# EasyEDA schematic SCH_RP2040-sussybaka_2024-10-22.json
TITLE: Amogus Buzzer - RP2040; REV: 2.0; Date: 2024-08-30; Sheet: 1/1; Company: Sussy Imposter Co.
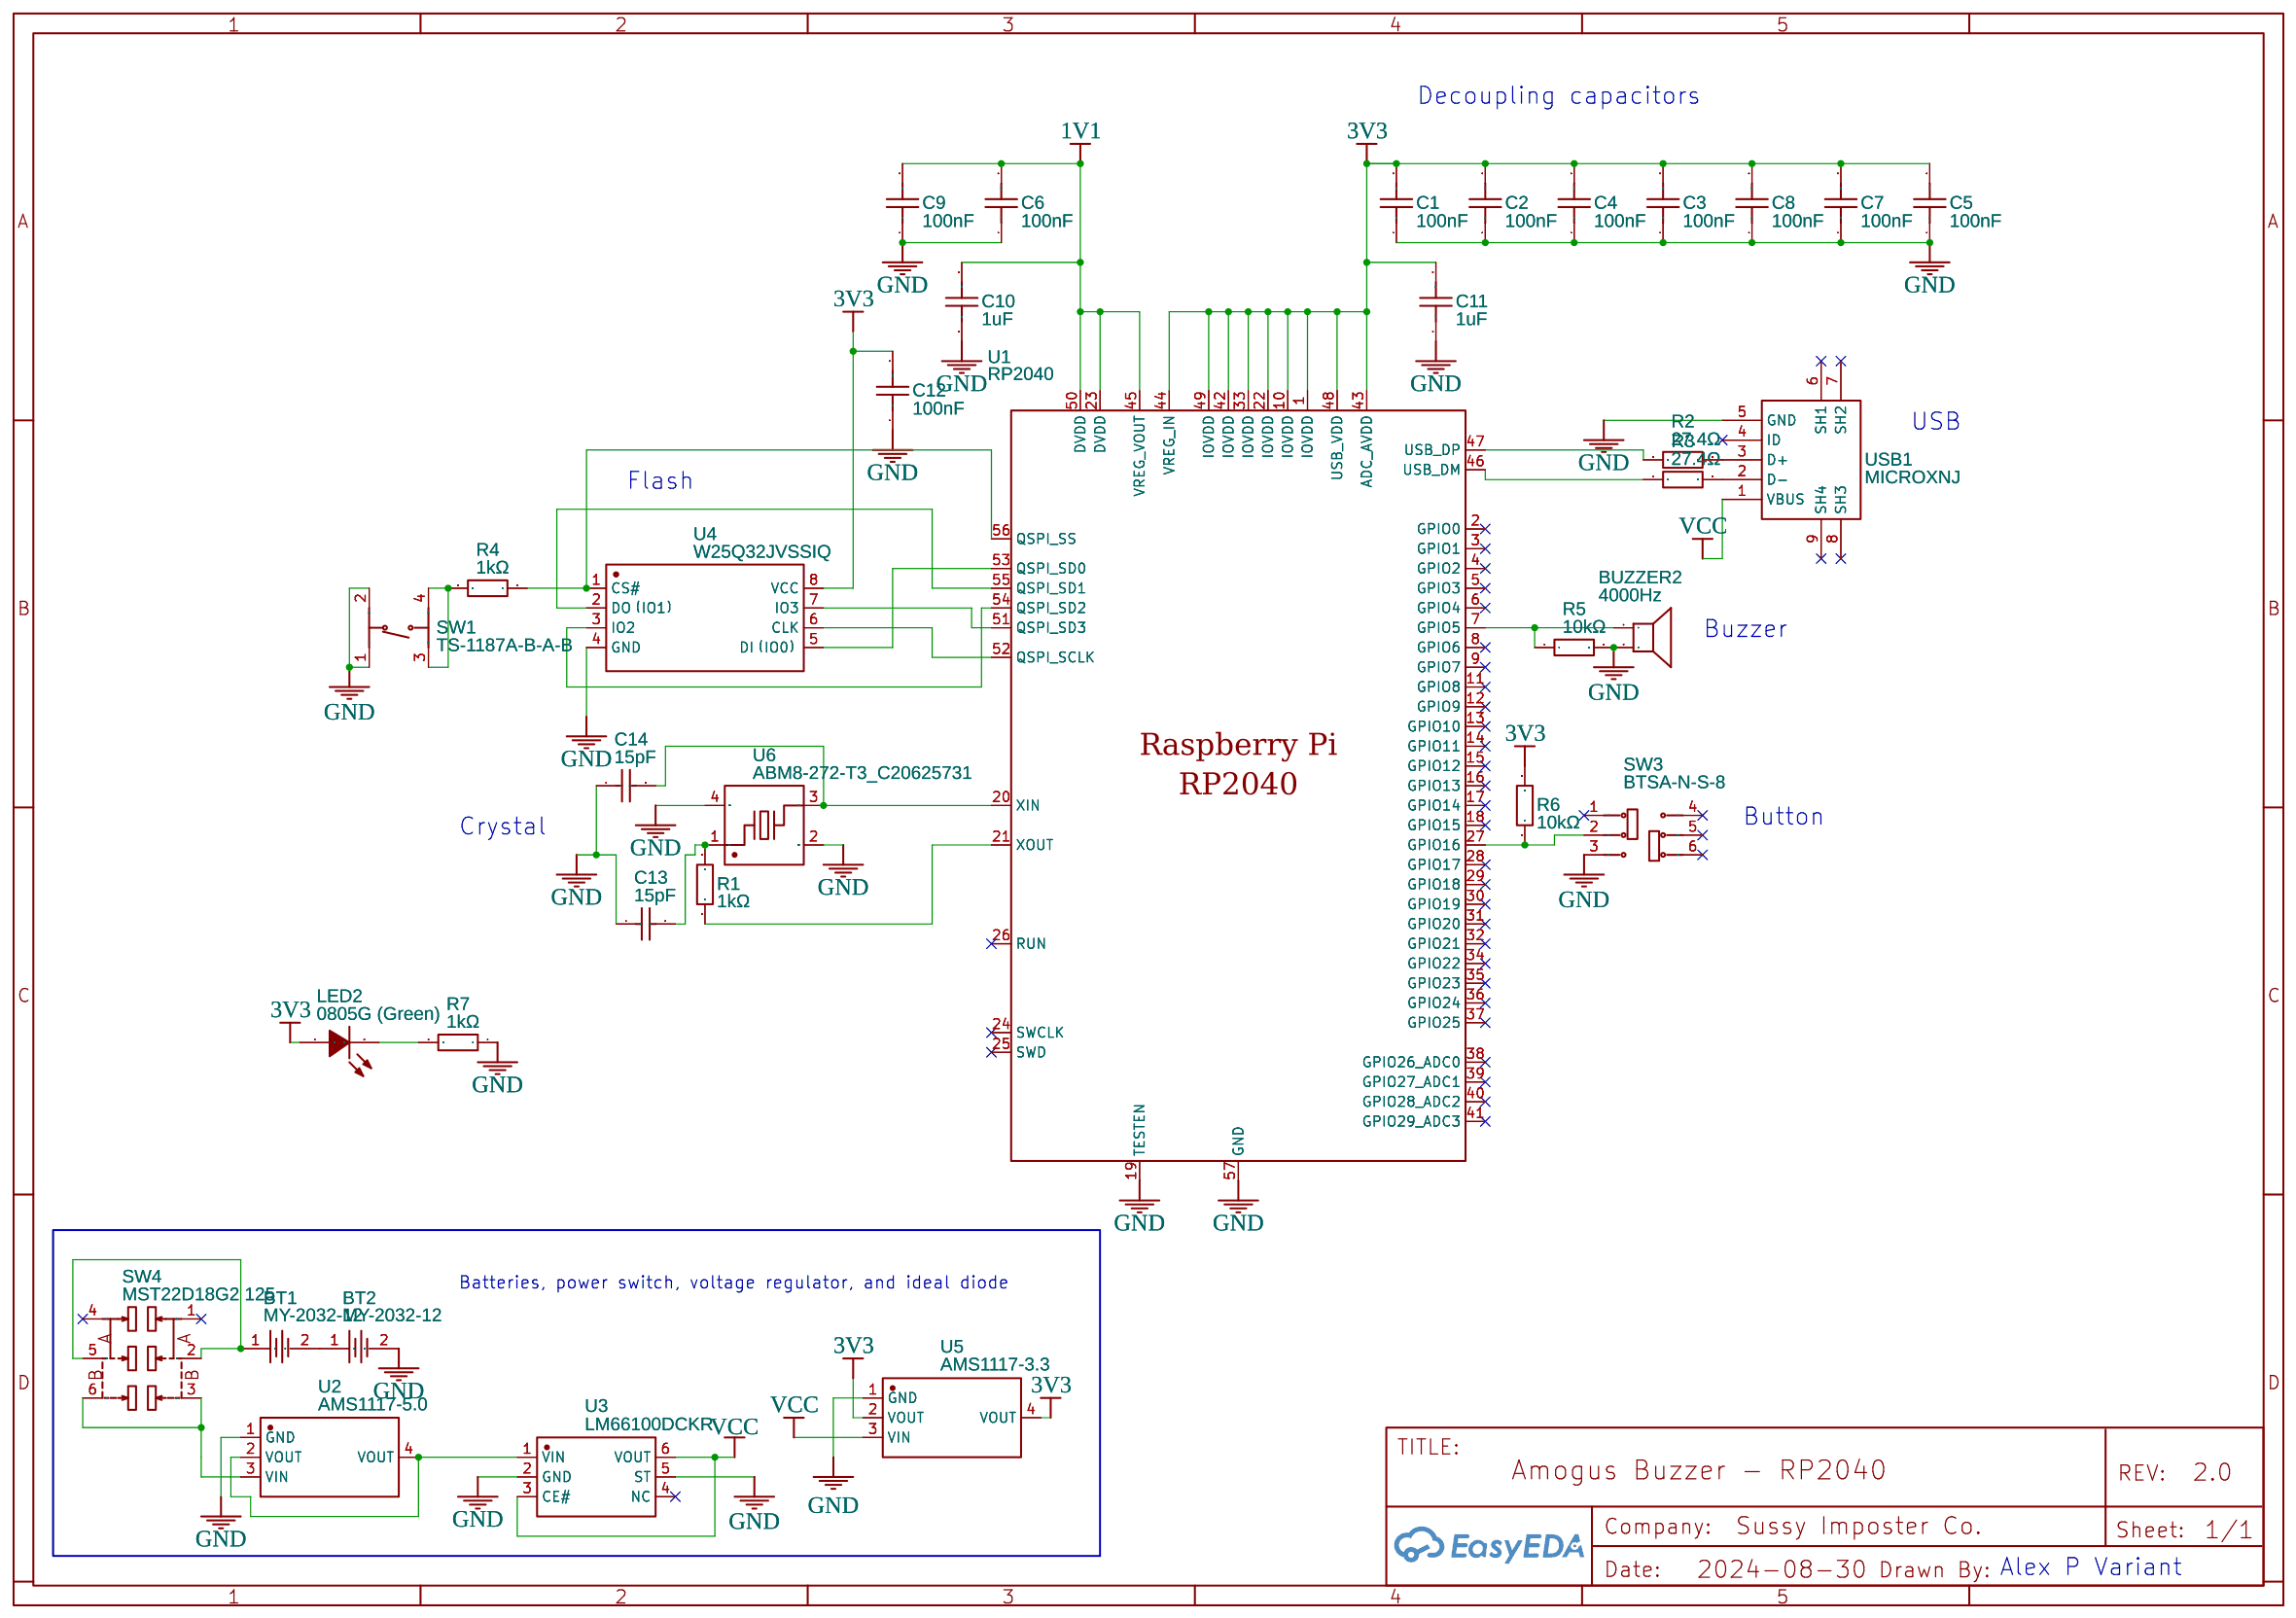
[diagram p0: schematic sheet]

## Parts
BT1  MY-2032-12  [BAT-SMD_MY-2032-12]
BT2  MY-2032-12  [BAT-SMD_MY-2032-12]
BUZZER2  4000Hz  [BUZ-TH_BD14.0-P7.60-D0.7]
C1  100nF  [C0402]
C2  100nF  [C0402]
C3  100nF  [C0402]
C4  100nF  [C0402]
C5  100nF  [C0402]
C6  100nF  [C0402]
C7  100nF  [C0402]
C8  100nF  [C0402]
C9  100nF  [C0402]
C10  1uF  [C0603]
C11  1uF  [C0603]
C12  100nF  [C0402]
C13  15pF  [C0402]
C14  15pF  [C0402]
LED2  0805G (Green)  [LED0805-R-RD]
R1  1kΩ  [R0603]
R2  27.4Ω  [R0603]
R3  27.4Ω  [R0603]
R4  1kΩ  [R0603]
R5  10kΩ  [R0603]
R6  10kΩ  [R0603]
R7  1kΩ  [R0603]
SW1  TS-1187A-B-A-B  [SW-SMD_4P-L5.1-W5.1-P3.70-LS6.5-TL-2]
SW3  BTSA-N-S-8  [SW-SMD_BTSA-N-S-8]
SW4  MST22D18G2 125  [SW-SMD_MST22D18G2]
U1  RP2040  [LQFN-56_L7.0-W7.0-P0.4-EP]
U2  AMS1117-5.0  [SOT-223_L6.5-W3.5-P2.30-LS7.0-BR]
U3  LM66100DCKR  [SC-70-6_L2.0-W1.3-P0.65-LS2.1-BL]
U4  W25Q32JVSSIQ  [SOIC-8_L5.3-W5.3-P1.27-LS8.0-BL]
U5  AMS1117-3.3  [SOT-223-3_L6.5-W3.4-P2.30-LS7.0-BR]
U6  ABM8-272-T3_C20625731  [CRYSTAL-SMD_4P-L3.2-W2.5-BL]
USB1  MICROXNJ  [MICRO-USB-SMD_MICROXNJ]

## Library data of the parts
BT1 BT2 = MY-2032-12: Contributor: LCSC; Supplier: LCSC; Supplier Part: C964833; Manufacturer: MYOUNG(美阳); JLCPCB Part Class: Extended Part
BUZZER2 = SFN-1407PA7.6: Contributor: LCSC; Supplier: LCSC; Supplier Part: C360603; Manufacturer: S&S(海旭); JLCPCB Part Class: Extended Part
C1-C9 C12 = CL05B104KO5NNNC: Supplier: LCSC; Manufacturer: SAMSUNG(三星); Supplier Part: C1525; JLCPCB Part Class: Basic Part
C10 C11 = CL10A105KB8NNNC: Supplier: LCSC; Manufacturer: SAMSUNG(三星); Supplier Part: C15849; JLCPCB Part Class: Basic Part
C13 C14 = 0402CG150J500NT: Supplier: LCSC; Manufacturer: FH(风华); Supplier Part: C1548; JLCPCB Part Class: Basic Part
LED2 = 0805G (Green): Supplier: LCSC; Manufacturer: KENTO; Manufacturer Part: KT-0805G; Supplier Part: C2297; JLCPCB Part Class: Basic Part
R1 R4 R7 = 0603WAF1001T5E: Supplier: LCSC; Manufacturer: UNI-ROYAL(厚声); Supplier Part: C21190; JLCPCB Part Class: Basic Part
R2 R3 = ARG03FTC27R4: Contributor: LCSC; Supplier: LCSC; Supplier Part: C217927; Manufacturer: Viking(光颉); JLCPCB Part Class: Extended Part
R5 R6 = 0603WAF1002T5E: Supplier: LCSC; Manufacturer: UNI-ROYAL(厚声); Supplier Part: C25804; JLCPCB Part Class: Basic Part
SW1 = TS-1187A-B-A-B: Contributor: LCSC; Supplier: LCSC; Supplier Part: C318884; Manufacturer: XKB Connectivity(中国星坤); JLCPCB Part Class: Basic Part
SW3 = BTSA-N-S-8: Contributor: LCSC; Supplier: LCSC; Supplier Part: C2693632; Manufacturer: ROCPU Switches(台普); JLCPCB Part Class: Extended Part
SW4 = MST22D18G2 125: Contributor: LCSC; Supplier: LCSC; Supplier Part: C2906280; Manufacturer: SHOU HAN(首韩); JLCPCB Part Class: Extended Part
U1 = RP2040: Contributor: LCSC; Supplier: LCSC; Supplier Part: C2040; Manufacturer: Raspberry Pi(树莓派); JLCPCB Part Class: Extended Part
U2 = AMS1117-5.0: sourceId: HltLFyQwq; Supplier: LCSC; Manufacturer: AMS; Supplier Part: C6187; JLCPCB Part Class: Basic Part
U3 = LM66100DCKR: Contributor: LCSC; Supplier: LCSC; Supplier Part: C2869734; Manufacturer: TI(德州仪器); JLCPCB Part Class: Extended Part
U4 = W25Q32JVSSIQ: Supplier: LCSC; Manufacturer: WINBOND(华邦); Supplier Part: C82344; JLCPCB Part Class: Extended Part
U5 = AMS1117-3.3: sourceId: dwIGgezVh; Supplier: LCSC; Manufacturer: AMS; Supplier Part: C6186; JLCPCB Part Class: Basic Part
U6 = ABM8-272-T3_C20625731: Supplier: LCSC; Supplier Part: C20625731; Manufacturer: ABRACON; Manufacturer Part: ABM8-272-T3; JLCPCB Part Class: Extended Part; Contributor: lcsc
USB1 = MICROXNJ: Contributor: LCSC; Supplier: LCSC; Supplier Part: C404969; Manufacturer: SHOU HAN(首韩); Manufacturer Part: MicroXNJ; JLCPCB Part Class: Extended Part

## Nets
1V1: C6.2 C9.2 C10.2 U1.23(DVDD) U1.45(VREG_VOUT) U1.50(DVDD)
3V3: C1.2 C2.2 C3.2 C4.2 C5.2 C7.2 C8.2 C11.2 C12.2 LED2.1(A) R6.2 U1.1(IOVDD) U1.10(IOVDD) U1.22(IOVDD) U1.33(IOVDD) U1.42(IOVDD) U1.43(ADC_AVDD) U1.44(VREG_IN) U1.48(USB_VDD) U1.49(IOVDD) U4.8(VCC) U5.2(VOUT) U5.4(VOUT)
GND: BT2.2 BUZZER2.2 C1.1 C2.1 C3.1 C4.1 C5.1 C6.1 C7.1 C8.1 C9.1 C10.1 C11.1 C12.1 C13.1 C14.1 R5.2 R7.1 SW1.1(A) SW1.2(B) SW3.3 U1.19(TESTEN) U1.57(GND) U2.1(GND) U3.2(GND) U3.5(ST) U4.4(GND) U5.1(GND) U6.2(GND) U6.4(GND) USB1.5(GND)
VCC: U3.3(CE#) U3.6(VOUT) U5.3(VIN) USB1.1(VBUS)
Net-(BT1-1): BT1.1 SW4.2 SW4.5
Net-(BT1-2): BT1.2 BT2.1
Net-(BUZZER2-1): BUZZER2.1 R5.1 U1.7(GPIO5)
Net-(C13-2): C13.2 R1.2 U6.1
Net-(C14-2): C14.2 U1.20(XIN) U6.3
Net-(LED2-2): LED2.2(K) R7.2
Net-(R1-1): R1.1 U1.21(XOUT)
Net-(R2-1): R2.1 U1.47(USB_DP)
Net-(R2-2): R2.2 USB1.3(D+)
Net-(R3-1): R3.1 U1.46(USB_DM)
Net-(R3-2): R3.2 USB1.2(D-)
Net-(R4-1): R4.1 U1.56(QSPI_SS) U4.1(CS#)
Net-(R4-2): R4.2 SW1.3(C) SW1.4(D)
Net-(R6-1): R6.1 SW3.2 U1.27(GPIO16)
Net-(SW4-3): SW4.3 SW4.6 U2.3(VIN)
Net-(U1-51): U1.51(QSPI_SD3) U4.7(IO3)
Net-(U1-52): U1.52(QSPI_SCLK) U4.6(CLK)
Net-(U1-53): U1.53(QSPI_SD0) U4.5(DI（IO0）)
Net-(U1-54): U1.54(QSPI_SD2) U4.3(IO2)
Net-(U1-55): U1.55(QSPI_SD1) U4.2(DO（IO1）)
Net-(U2-2): U2.2(VOUT) U2.4(VOUT) U3.1(VIN)

Not connected (* = marked no-connect by the designer): SW3 1* 4* 5* 6*; SW4 1* 4*; U1 2(GPIO0)* 3(GPIO1)* 4(GPIO2)* 5(GPIO3)* 6(GPIO4)* 8(GPIO6)* 9(GPIO7)* 11(GPIO8)* 12(GPIO9)* 13(GPIO10)* 14(GPIO11)* 15(GPIO12)* 16(GPIO13)* 17(GPIO14)* 18(GPIO15)* 24(SWCLK)* 25(SWD)* 26(RUN)* 28(GPIO17)* 29(GPIO18)* 30(GPIO19)* 31(GPIO20)* 32(GPIO21)* 34(GPIO22)* 35(GPIO23)* 36(GPIO24)* 37(GPIO25)* 38(GPIO26_ADC0)* 39(GPIO27_ADC1)* 40(GPIO28_ADC2)* 41(GPIO29_ADC3)*; U3 4(NC)*; USB1 4(ID)* 6(SH1)* 7(SH2)* 8(SH3)* 9(SH4)*

## Notes on the sheet
- Decoupling capacitors
- USB
- Flash
- Buzzer
- Crystal
- Button
- Batteries, power switch, voltage regulator, and ideal diode
- Alex P Variant
